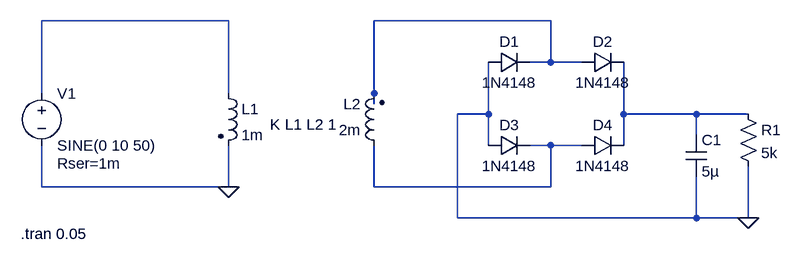
[diagram p0: schematic FULL WAVE RECTIFIER.asc]
FULL WAVE RECTIFIER.asc, the LTspice schematic file:
Version 4
SHEET 1 880 680
WIRE -256 48 -544 48
WIRE 240 48 -32 48
WIRE 240 112 240 48
WIRE 240 112 208 112
WIRE 288 112 240 112
WIRE -544 160 -544 48
WIRE -256 160 -256 48
WIRE -32 160 -32 48
WIRE -32 176 -32 160
WIRE 144 192 144 112
WIRE 144 192 96 192
WIRE 352 192 352 112
WIRE 464 192 352 192
WIRE 544 192 464 192
WIRE 464 224 464 192
WIRE 144 240 144 192
WIRE 240 240 208 240
WIRE 288 240 240 240
WIRE 352 240 352 192
WIRE -544 304 -544 240
WIRE -256 304 -256 240
WIRE -256 304 -544 304
WIRE -32 304 -32 240
WIRE 240 304 240 240
WIRE 240 304 -32 304
WIRE 96 352 96 192
WIRE 464 352 464 288
WIRE 464 352 96 352
WIRE 544 352 544 272
WIRE 544 352 464 352
FLAG -256 304 0
FLAG 544 352 0
SYMBOL voltage -544 144 R0
WINDOW 123 0 0 Left 0
WINDOW 39 24 124 Left 2
SYMATTR SpiceLine Rser=1m
SYMATTR InstName V1
SYMATTR Value SINE(0 10 50)
SYMBOL ind2 -272 144 R0
SYMATTR InstName L1
SYMATTR Value 1m
SYMATTR Type ind
SYMBOL ind2 -16 256 R180
WINDOW 0 36 80 Left 2
WINDOW 3 36 40 Left 2
SYMATTR InstName L2
SYMATTR Value 2m
SYMATTR Type ind
SYMBOL diode 144 128 R270
WINDOW 0 32 32 VTop 2
WINDOW 3 0 32 VBottom 2
SYMATTR InstName D1
SYMATTR Value 1N4148
SYMBOL diode 288 128 R270
WINDOW 0 32 32 VTop 2
WINDOW 3 0 32 VBottom 2
SYMATTR InstName D2
SYMATTR Value 1N4148
SYMBOL diode 144 256 R270
WINDOW 0 32 32 VTop 2
WINDOW 3 0 32 VBottom 2
SYMATTR InstName D3
SYMATTR Value 1N4148
SYMBOL diode 288 256 R270
WINDOW 0 32 32 VTop 2
WINDOW 3 0 32 VBottom 2
SYMATTR InstName D4
SYMATTR Value 1N4148
SYMBOL res 528 176 R0
SYMATTR InstName R1
SYMATTR Value 5k
SYMBOL cap 448 224 R0
SYMATTR InstName C1
SYMATTR Value 5µ
TEXT -192 208 Left 2 !K L1 L2 1
TEXT -576 376 Left 2 !.tran 0.05

The netlist it stands for:
* FULL WAVE RECTIFIER.asc
V1 N001 0 SINE(0 10 50) Rser=1m
L1 N001 0 1m
L2 N004 N002 2m
D1 0 N002 1N4148
D2 N002 N003 1N4148
D3 0 N004 1N4148
D4 N004 N003 1N4148
R1 N003 0 5k
C1 N003 0 5µ
.model D D
.lib standard.dio
K L1 L2 1
.tran 0.05
.backanno
.end